# Altium schematic sheet LPC1769.SchDoc: Motor Monitoring
size A3; Organization: NTUST EE-305; Address1: No.43, Sec. 4, Keelung Rd.; Address2: Da’an Dist.; Address3: Taipei 106; Address4: Taiwan (R.O.C.); Revision: 2.0; SheetNumber: 1; SheetTotal: 4
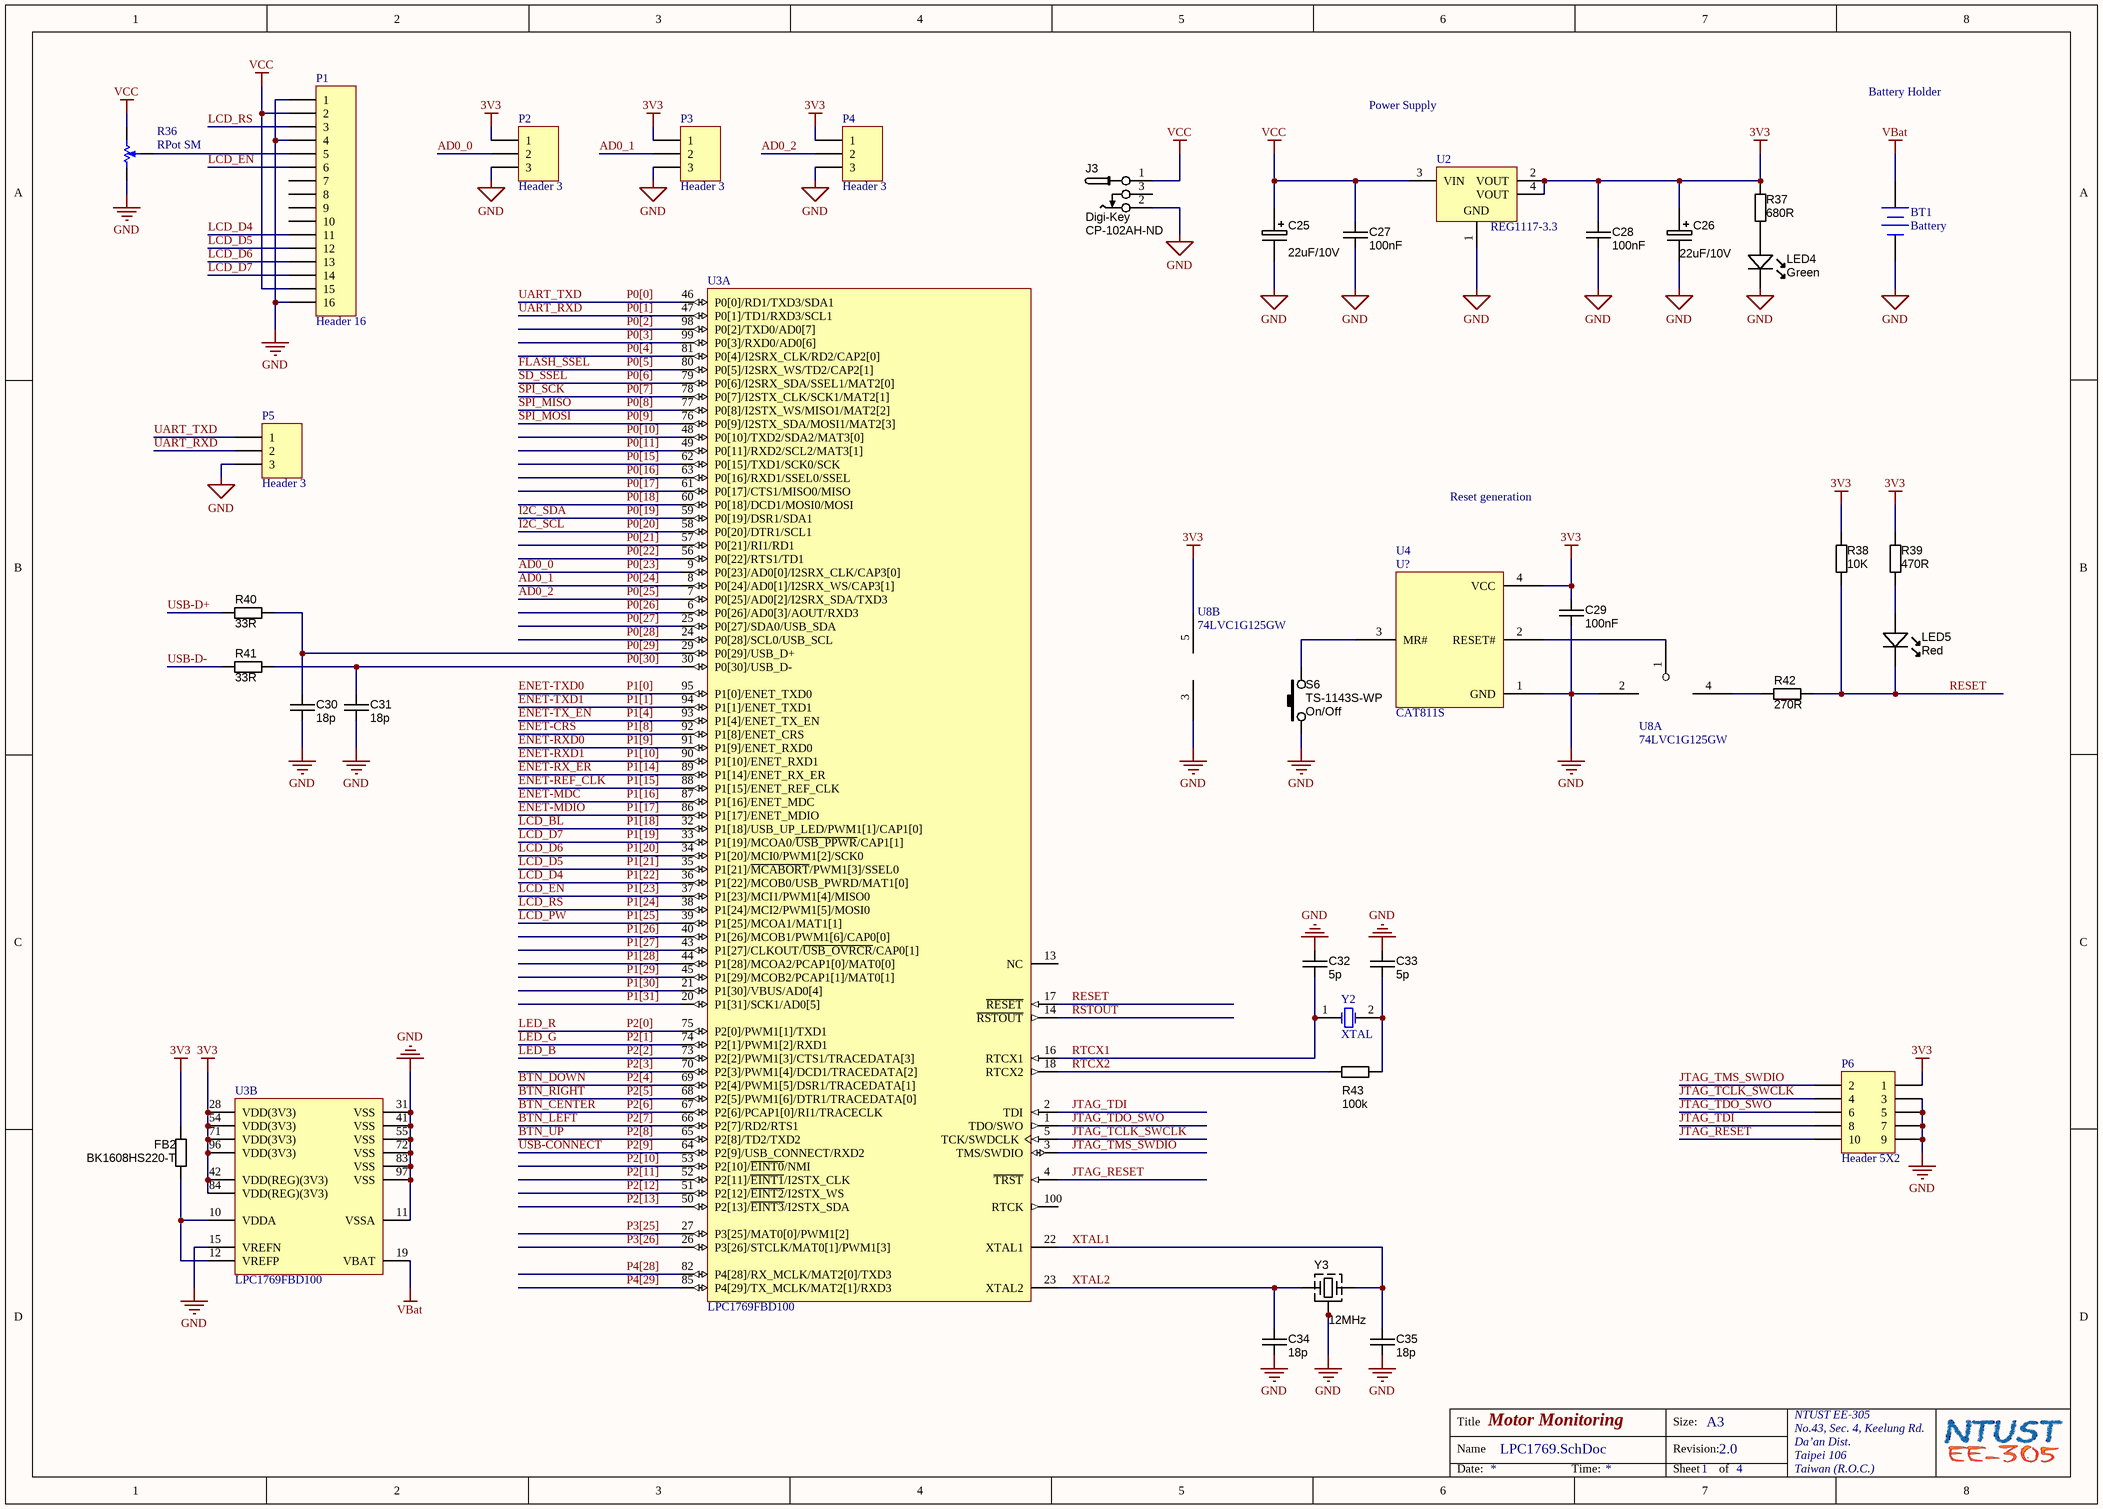
[diagram p0: LPC1769.SchDoc]

## Parts
BT1  Battery  [BAT-2]
C25  (no value)  [CAP_ELEC_5x5.7]
C26  (no value)  [CAP_ELEC_5x5.7]
C27  value 100nF  [CAPC1608N]  (hidden comment: approved sub OK)
C28  value 100nF  [CAPC1608N]  (hidden comment: approved sub OK)
C29  value 100nF  [CAPC1005N]  (hidden comment: approved sub OK)
C30  value 18p  [CAPC1608N]  (hidden comment: approved sub OK)
C31  value 18p  [CAPC1608N]  (hidden comment: approved sub OK)
C32  value 5p  [CAPC1005N]  (hidden comment: approved sub OK)
C33  value 5p  [CAPC1005N]  (hidden comment: approved sub OK)
C34  value 18p  [CAPC1005N]  (hidden comment: approved sub OK)
C35  value 18p  [CAPC1005N]  (hidden comment: approved sub OK)
FB2  value BK1608HS220-T  [RESC2012N]  (hidden comment: Thick Film)
J3  Supplier 1: Digi-Key  Supplier Part Number 1: CP-102AH-ND  [CONN_PWR_JACK_2.1x5.5mm]  (hidden comment: CONN_PWR_JACK_2.1x5.5mm)
LED4  Green  [LED-0603-GREEN]
LED5  Red  [LED-0603-GREEN]
P1  Header 16  [HDR1X16]
P2  Header 3  [HDR1X3]
P3  Header 3  [HDR1X3]
P4  Header 3  [HDR1X3]
P5  Header 3  [HDR1X3]
P6  Header 5X2  [Header 5x2p]
R36  RPot SM  [POT4MM-2]
R37  value 680R  [RESC1005N]  (hidden comment: Thick Film)
R38  value 10K  [RESC1005N]  (hidden comment: Thick Film)
R39  value 470R  [RESC1005N]  (hidden comment: Thick Film)
R40  value 33R  [RESC1608N]  (hidden comment: Thick Film)
R41  value 33R  [RESC1608N]  (hidden comment: Thick Film)
R42  value 270R  [RESC1005N]  (hidden comment: Thick Film)
R43  value 100k  [RESC1005N]  (hidden comment: Thick Film)
S6  TS-1143S-WP  Function: On/Off  [TS-1143S]
U2  REG1117-3.3  [TI-DCY4_N]
U3  LPC1769FBD100  [SOT407-1_V]  (parts A,B of 2)
U4  CAT811S  [SOT-143-RC4_N]
U8  74LVC1G125GW  [SOT-23-CT5_N]  (parts A,B of 2)
Y2  XTAL  [HC49/4H_SMX]
Y3  12MHz  [CRYSTAL_4-LCC]

## Nets
3V3: C26.1 C28.2 C29.1 FB2.2 P2.1 P3.1 P4.1 P6.1 R37.2 R38.2 R39.2 U2.2(VOUT) U2.4(VOUT) U3.28(VDD(3V3)) U3.42(VDD(REG)(3V3)) U3.54(VDD(3V3)) U3.71(VDD(3V3)) U3.84(VDD(REG)(3V3)) U3.96(VDD(3V3)) U4.4(VCC) U8.5(VCC)
GND: BT1.2(-) C25.2 C26.2 C27.2 C28.1 C29.2 C30.1 C31.1 C32.2 C33.2 C34.1 C35.1 J3.2 LED4.K P1.1 P1.4 P1.16 P2.3 P3.3 P4.3 P5.3 P6.3 P6.5 P6.7 P6.9 R36.CCW(-) S6.1 U2.1(GND) U3.11(VSSA) U3.15(VREFN) U3.31(VSS) U3.41(VSS) U3.55(VSS) U3.72(VSS) U3.83(VSS) U3.97(VSS) U4.1(GND) U8.2(A) U8.3(GND) Y3.2(GND) Y3.4(GND)
VBat: BT1.1(+) U3.19(VBAT)
VCC: C25.1 C27.1 J3.1 P1.2 P1.15 R36.CW(+) U2.3(VIN)
AD0_0: P2.2 U3.9(P0[23]/AD0[0]/I2SRX_CLK/CAP3[0])  [also labelled P0[23]]
AD0_1: P3.2 U3.8(P0[24]/AD0[1]/I2SRX_WS/CAP3[1])  [also labelled P0[24]]
AD0_2: P4.2 U3.7(P0[25]/AD0[2]/I2SRX_SDA/TXD3)  [also labelled P0[25]]
BTN_CENTER: U3.67(P2[6]/PCAP1[0]/RI1/TRACECLK)  [also labelled P2[6]]
BTN_DOWN: U3.69(P2[4]/PWM1[5]/DSR1/TRACEDATA[1])  [also labelled P2[4]]
BTN_LEFT: U3.66(P2[7]/RD2/RTS1)  [also labelled P2[7]]
BTN_RIGHT: U3.68(P2[5]/PWM1[6]/DTR1/TRACEDATA[0])  [also labelled P2[5]]
BTN_UP: U3.65(P2[8]/TD2/TXD2)  [also labelled P2[8]]
ENET-CRS: U3.92(P1[8]/ENET_CRS)  [also labelled P1[8]]
ENET-MDC: U3.87(P1[16]/ENET_MDC)  [also labelled P1[16]]
ENET-MDIO: U3.86(P1[17]/ENET_MDIO)  [also labelled P1[17]]
ENET-REF_CLK: U3.88(P1[15]/ENET_REF_CLK)  [also labelled P1[15]]
ENET-RX_ER: U3.89(P1[14]/ENET_RX_ER)  [also labelled P1[14]]
ENET-RXD0: U3.91(P1[9]/ENET_RXD0)  [also labelled P1[9]]
ENET-RXD1: U3.90(P1[10]/ENET_RXD1)  [also labelled P1[10]]
ENET-TX_EN: U3.93(P1[4]/ENET_TX_EN)  [also labelled P1[4]]
ENET-TXD0: U3.95(P1[0]/ENET_TXD0)  [also labelled P1[0]]
ENET-TXD1: U3.94(P1[1]/ENET_TXD1)  [also labelled P1[1]]
FLASH_SSEL: U3.80(P0[5]/I2SRX_WS/TD2/CAP2[1])  [also labelled P0[5]]
I2C_SCL: U3.58(P0[20]/DTR1/SCL1)  [also labelled P0[20]]
I2C_SDA: U3.59(P0[19]/DSR1/SDA1)  [also labelled P0[19]]
JTAG_RESET: P6.10 U3.4(~{TRST})
JTAG_TCLK_SWCLK: P6.4 U3.5(TCK/SWDCLK)
JTAG_TDI: P6.8 U3.2(TDI)
JTAG_TDO_SWO: P6.6 U3.1(TDO/SWO)
JTAG_TMS_SWDIO: P6.2 U3.3(TMS/SWDIO)
LCD_BL: U3.32(P1[18]/USB_UP_LED/PWM1[1]/CAP1[0])  [also labelled P1[18]]
LCD_D4: P1.11 U3.36(P1[22]/MCOB0/USB_PWRD/MAT1[0])  [also labelled P1[22]]
LCD_D5: P1.12 U3.35(P1[21]/~{MCABORT}/PWM1[3]/SSEL0)  [also labelled P1[21]]
LCD_D6: P1.13 U3.34(P1[20]/MCI0/PWM1[2]/SCK0)  [also labelled P1[20]]
LCD_D7: P1.14 U3.33(P1[19]/MCOA0/~{USB_PPWR}/CAP1[1])  [also labelled P1[19]]
LCD_EN: P1.6 U3.37(P1[23]/MCI1/PWM1[4]/MISO0)  [also labelled P1[23]]
LCD_PW: U3.39(P1[25]/MCOA1/MAT1[1])  [also labelled P1[25]]
LCD_RS: P1.3 U3.38(P1[24]/MCI2/PWM1[5]/MOSI0)  [also labelled P1[24]]
LED_B: U3.73(P2[2]/PWM1[3]/CTS1/TRACEDATA[3])  [also labelled P2[2]]
LED_G: U3.74(P2[1]/PWM1[2]/RXD1)  [also labelled P2[1]]
LED_R: U3.75(P2[0]/PWM1[1]/TXD1)  [also labelled P2[0]]
P0[0]: P5.1 U3.46(P0[0]/RD1/TXD3/SDA1)  [also labelled UART_TXD]
P0[1]: P5.2 U3.47(P0[1]/TD1/RXD3/SCL1)  [also labelled UART_RXD]
P0[2]: U3.98(P0[2]/TXD0/AD0[7])
P0[3]: U3.99(P0[3]/RXD0/AD0[6])
P0[4]: U3.81(P0[4]/I2SRX_CLK/RD2/CAP2[0])
P0[6]: U3.79(P0[6]/I2SRX_SDA/SSEL1/MAT2[0])  [also labelled SD_SSEL]
P0[7]: U3.78(P0[7]/I2STX_CLK/SCK1/MAT2[1])  [also labelled SPI_SCK]
P0[8]: U3.77(P0[8]/I2STX_WS/MISO1/MAT2[2])  [also labelled SPI_MISO]
P0[9]: U3.76(P0[9]/I2STX_SDA/MOSI1/MAT2[3])  [also labelled SPI_MOSI]
P0[10]: U3.48(P0[10]/TXD2/SDA2/MAT3[0])
P0[11]: U3.49(P0[11]/RXD2/SCL2/MAT3[1])
P0[15]: U3.62(P0[15]/TXD1/SCK0/SCK)
P0[16]: U3.63(P0[16]/RXD1/SSEL0/SSEL)
P0[17]: U3.61(P0[17]/CTS1/MISO0/MISO)
P0[18]: U3.60(P0[18]/DCD1/MOSI0/MOSI)
P0[21]: U3.57(P0[21]/RI1/RD1)
P0[22]: U3.56(P0[22]/RTS1/TD1)
P0[26]: U3.6(P0[26]/AD0[3]/AOUT/RXD3)
P0[27]: U3.25(P0[27]/SDA0/USB_SDA)
P0[28]: U3.24(P0[28]/SCL0/USB_SCL)
P0[29]: C30.2 R40.1 U3.29(P0[29]/USB_D+)
P0[30]: C31.2 R41.1 U3.30(P0[30]/USB_D-)
P1[26]: U3.40(P1[26]/MCOB1/PWM1[6]/CAP0[0])
P1[27]: U3.43(P1[27]/CLKOUT/~{USB_OVRCR}/CAP0[1])
P1[28]: U3.44(P1[28]/MCOA2/PCAP1[0]/MAT0[0])
P1[29]: U3.45(P1[29]/MCOB2/PCAP1[1]/MAT0[1])
P1[30]: U3.21(P1[30]/VBUS/AD0[4])
P1[31]: U3.20(P1[31]/SCK1/AD0[5])
P2[3]: U3.70(P2[3]/PWM1[4]/DCD1/TRACEDATA[2])
P2[9]: U3.64(P2[9]/USB_CONNECT/RXD2)  [also labelled USB-CONNECT]
P2[10]: U3.53(P2[10]/~{EINT0}/NMI)
P2[11]: U3.52(P2[11]/~{EINT1}/I2STX_CLK)
P2[12]: U3.51(P2[12]/~{EINT2}/I2STX_WS)
P2[13]: U3.50(P2[13]/~{EINT3}/I2STX_SDA)
P3[25]: U3.27(P3[25]/MAT0[0]/PWM1[2])
P3[26]: U3.26(P3[26]/STCLK/MAT0[1]/PWM1[3])
P4[28]: U3.82(P4[28]/RX_MCLK/MAT2[0]/TXD3)
P4[29]: U3.85(P4[29]/TX_MCLK/MAT2[1]/RXD3)
RESET: LED5.K R38.1 R42.1 U3.17(~{RESET})
RSTOUT: U3.14(~{RSTOUT})
RTCX1: C32.1 U3.16(RTCX1) Y2.1(OSC1)
RTCX2: R43.2 U3.18(RTCX2)
USB-D+: R40.2
USB-D-: R41.2
XTAL1: C35.2 U3.22(XTAL1) Y3.3(X)
XTAL2: C34.2 U3.23(XTAL2) Y3.1(X)
NetC33_1: C33.1 R43.1 Y2.2(OSC2)
NetFB2_1: FB2.1 U3.10(VDDA) U3.12(VREFP)
NetLED4_A: LED4.A R37.1
NetLED5_A: LED5.A R39.1
NetP1_5: P1.5 R36.W
NetR42_2: R42.2 U8.4(Y)
NetS6_2: S6.2 U4.3(MR#)
NetU4_2: U4.2(RESET#) U8.1(~{OE})

Not connected (* = marked no-connect by the designer): J3 3; P1 7 8 9 10; U3 13(NC) 100(RTCK)

## Notes on the sheet
- Power Supply
- Battery Holder
- Reset generation
- Title
- Name
- Size:
- Revision:
- A3
- Date:
- Time:
- Sheet
- of
- (in symbol CAPT_100u_1210_6V3) 22uF/10V
- (in symbol CAT811S) U?

## Library data of the parts
BT1 = Battery: Multicell Battery; Published: 24-Mar-1999; LatestRevisionDate: 17-Jul-2002; LatestRevisionNote: Re-released for DXP Platform.; PackageReference: BAT-2; Publisher: Altium Limited; PackageDescription: Battery; 2 Leads
C25 C26 = CAPT_100u_1210_6V3: Capacitor SMD Tantalum 100uF 20% 6.3V 1210; Manufacturer 1: AVX Corporation; Manufacturer Part Number 1: TCJB107M006R0045; Tolerance: ?0%; Package / Case: 1210 (3528 Metric); Material: Tantalum; Supplier 1: Digi-Key; Supplier Part Number 1: 478-4711-1-ND
C27-C35 = CAPC_100n_0805: Capacitor SMD Cer 100nF 10% 50V X7R 0805; Manufacturer 1: Kemet; Manufacturer Part Number 1: C0805C104K5RACTU; Tolerance: ?0%; Ratings: 50V; X7R; Material: ceramic; Package / Case: 0805 (2012 metric); Supplier 1: Digi-Key; Supplier Part Number 1: 399-1170-1-ND
FB2 R38 R40 R41 R43 = RES_10K_0805_5%: Resistor SMD chip 10k Ohm 0.125W 5% 0805; Manufacturer 1: Yageo; Manufacturer Part Number 1: RC0805JR-0710KL; Ratings: 1/8 W; Tolerance: ?%; Package / Case: 0805 (2012 metric); Material: Thick Film; Supplier 1: Digi-Key; Supplier Part Number 1: 311-10KARCT-ND
J3 = CONN_PWR_JACK_2.1x5.5mm: Power Connector, THT, 2.1mm ID, 5.5mm OD; Manufacturer 1: CUI Inc; Manufacturer Part Number 1: PJ-102AH; Category: Connectors; Mounting Type: Through Hole; Package / Case: PCB mount; Value: 2.1mm ID, 5.5mm OD
LED4 = LED_SMD_Green_0805_8mcd: LED, 0805 SMD, Green; Manufacturer 1: Ligitek; Manufacturer Part Number 1: LG-170PG-CT; Material: GaP; Ratings: 8 mcd; 558 nm; Package / Case: 0805
LED5 = LED_SMD_Red_0805: LED, 0805 SMD, Red; Manufacturer 1: Ligitek; Manufacturer Part Number 1: LG170SR-CT; Material: GaAIAs; Ratings: 20 mcd; 643 nm; Package / Case: 0805
P1 = Header 16: Header, 16-Pin; LatestRevisionDate: 17-Jul-2002; LatestRevisionNote: Re-released for DXP Platform.; Publisher: Altium Limited
P2-P5 = Header 3: Header, 3-Pin; LatestRevisionDate: 17-Jul-2002; LatestRevisionNote: Re-released for DXP Platform.; Publisher: Altium Limited
P6 = Header 5X2: Header, 5-Pin, Dual row; LatestRevisionDate: 17-Jul-2002; LatestRevisionNote: Re-released for DXP Platform.; Publisher: Altium Limited
R36 = RPot SM: Square Trimming Potentiometer; Published: 17-Dec-2003; DatasheetVersion: Oct-2003; PackageReference: POT4MM-2; Publisher: Altium Limited; PackageDescription: Square Trimming Potentiometer; ComponentLink1Description: Manufacturer Link; ComponentLink1URL: http://bourns.com/2/search.html
R37 R42 = RES_330R_0402_5%: Resistor SMD chip 330 Ohm 0.063W 5% 0402; Manufacturer 1: Yageo; Manufacturer Part Number 1: RC0402JR-07330RL; Ratings: 1/16 W; Tolerance: ?%; Package / Case: 0402 (1005 Metric); Supplier 1: Digi-Key; Supplier Part Number 1: 311-330JRCT-ND; ComponentLink1URL: http://www.yageo.com/documents/recent/PYu-RC0402_51_RoHS_L_6.pdf; ComponentLink1Description: http://www.yageo.com/documents/recent/PYu-RC0402_51_RoHS_L_6.pdf
R39 = RES_470R_0603_5%: Resistor SMD chip 470 Ohm 0.1W 5% 0603; Manufacturer 1: Vishay/Dale; Manufacturer Part Number 1: CRCW0603470RJNEA; Ratings: 1/10 W; Tolerance: ?%; Package / Case: 0603 (1608 metric); Material: Thick Film; Supplier 1: Digi-Key; Supplier Part Number 1: 541-470GCT-ND
S6 = SW_SMD_PB_4.3mm: Switch SMD Tact 4.3mm Stem; Manufacturer 1: Bond-Tact; Manufacturer Part Number 1: TS-1143S-WP-200; Package / Case: 6.5x6.5mm; 4.3mm stem
U2 = REG1117-3.3: Single Output LDO, 800 mA, Fixed 3.3 V Output, 3.8 to 15 V Input, with Internal Current Limiting, 4-pin SOT-223 (DCY), -40 to 125 degC, Green (RoHS & no Sb/Br); Manufacturer: Texas Instruments; Fixed Output Options(V): 5; Iout(Max)(A): 0.8; Iq(Typ)(mA): 4; Rating: Catalog; SubFamily: Single Channel LDO; Vdo(Typ)(mV): 1100; Vin(Max)(V): 15; Vin(Min)(V): 3.8; Vout Adj(Max)(V): 3.3; DatasheetVersion: SBVS001D; PackageVersion: 4202506/B; PackageReference: DCY4; PackageDescription: 4-Pin Plastic Small Outline, Body 3.5 x 6.5 mm, Pitch 2.3 mm; Supplier 1: Digi-Key; Supplier Part Number 1: REG1117-3.3-ND; Supplier 2: Farnell; Supplier Part Number 2: 1212355; Supplier 3: Farnell; Supplier Part Number 3: 2126471; Supplier 4: Newark; Supplier Part Number 4: 35C1963; Supplier 5: Mouser; Supplier Part Number 5: 595-REG1117-3.3; Eco-Plan: Green (RoHS & no Sb/Br); Vout Adj(Min)(V): 3.3; Mounting Technology: Surface Mount; Code_JEDEC: TO-261; PartNumber: REG1117-3.3; ComponentLink1Description: Manufacturer URL; ComponentLink1URL: http://www.ti.com/; ComponentLink2Description: Datasheet; ComponentLink2URL: http://www.ti.com/general/docs/lit/getliterature.tsp?genericPartNumber=REG1117-33&fileType=pdf; ComponentLink3Description: Package Specification; ComponentLink3URL: http://www.ti.com/litv/pdf/mpds094a
U3 = LPC1769FBD100: 32-bit ARM Cortex-M3 MCU, 512 kB Flash, 64 kB SRAM, Ethernet, USB 2.0 Device/Host/OTG, 12-Bit ADC, DAC, I2S, 100-Pin LQFP; fmax: 120 MHz; SRAM: 64 kB; Flash: 512 kB; GPIOs: 70; USB: 1; CAN: 2; UART: 4; PWM: 6; PLL: Y; ADC channels: 8; VDD (min): 2.4 V; VDD (typ): 3.3 V; VDD (max): 3.6 V; Code_IEC: 136E20; DatasheetVersion: Rev. 8, Nov-2011; PackageVersion: Feb-2003; PackageReference: SOT407-1; PackageDescription: LQFP100: Plastic Low Profile Quad Flat Package; 100 Leads; Body 14 x 14 x 1.4 mm; SPI: 1; SSP: 2; Timers: 4; Code_JEDEC: MS-026; PartNumber: LPC1769FBD100; ComponentLink1Description: Manufacturer URL; ComponentLink1URL: http://www.nxp.com/; ComponentLink2Description: Datasheet; ComponentLink2URL: http://www.nxp.com/documents/data_sheet/LPC1769_68_67_66_65_64_63.pdf
Y2 = XTAL: Crystal Oscillator; Published: 8-Jun-2000; LatestRevisionDate: 17-Jul-2002; LatestRevisionNote: Re-released for DXP Platform.; PackageReference: R38; Publisher: Altium Limited; PackageDescription: Crystal, Thru-Hole; 2 Leads; Body 3.1 x 8.2 mm (Dia.xH)
Y3 = CRYSTAL_27M12: Oscillator Crystal 27.12 MHz 10ppm; Manufacturer 1: TXC CORPORATION; Manufacturer Part Number 1: 7M-27.120MEEQ-T; Ratings: 4.9152 MHz Crystal; Frequency Stability: ?0ppm; Load Capacitance: 10pF; Operating Mode: Fundamental; Package / Case: 2.5mm pitch; Material: Ceramic; Supplier 1: Digi-Key; Supplier Part Number 1: 887-1329-1-ND; Type: MHz Crystal; Frequency Tolerance: ?0ppm; Operating Temperature: -20蚓 ~ 70蚓; Mounting Type: Surface Mount; Size / Dimension: 0.126" L x 0.098" W (3.20mm x 2.50mm); ComponentLink1URL: http://www.txccrystal.com/images/pdf/7m-accuracy.pdf; ComponentLink1Description: http://www.txccrystal.com/images/pdf/7m-accuracy.pdf